# EAGLE board OpenDeck-r2.1.0 (EAGLE 7.4.0)
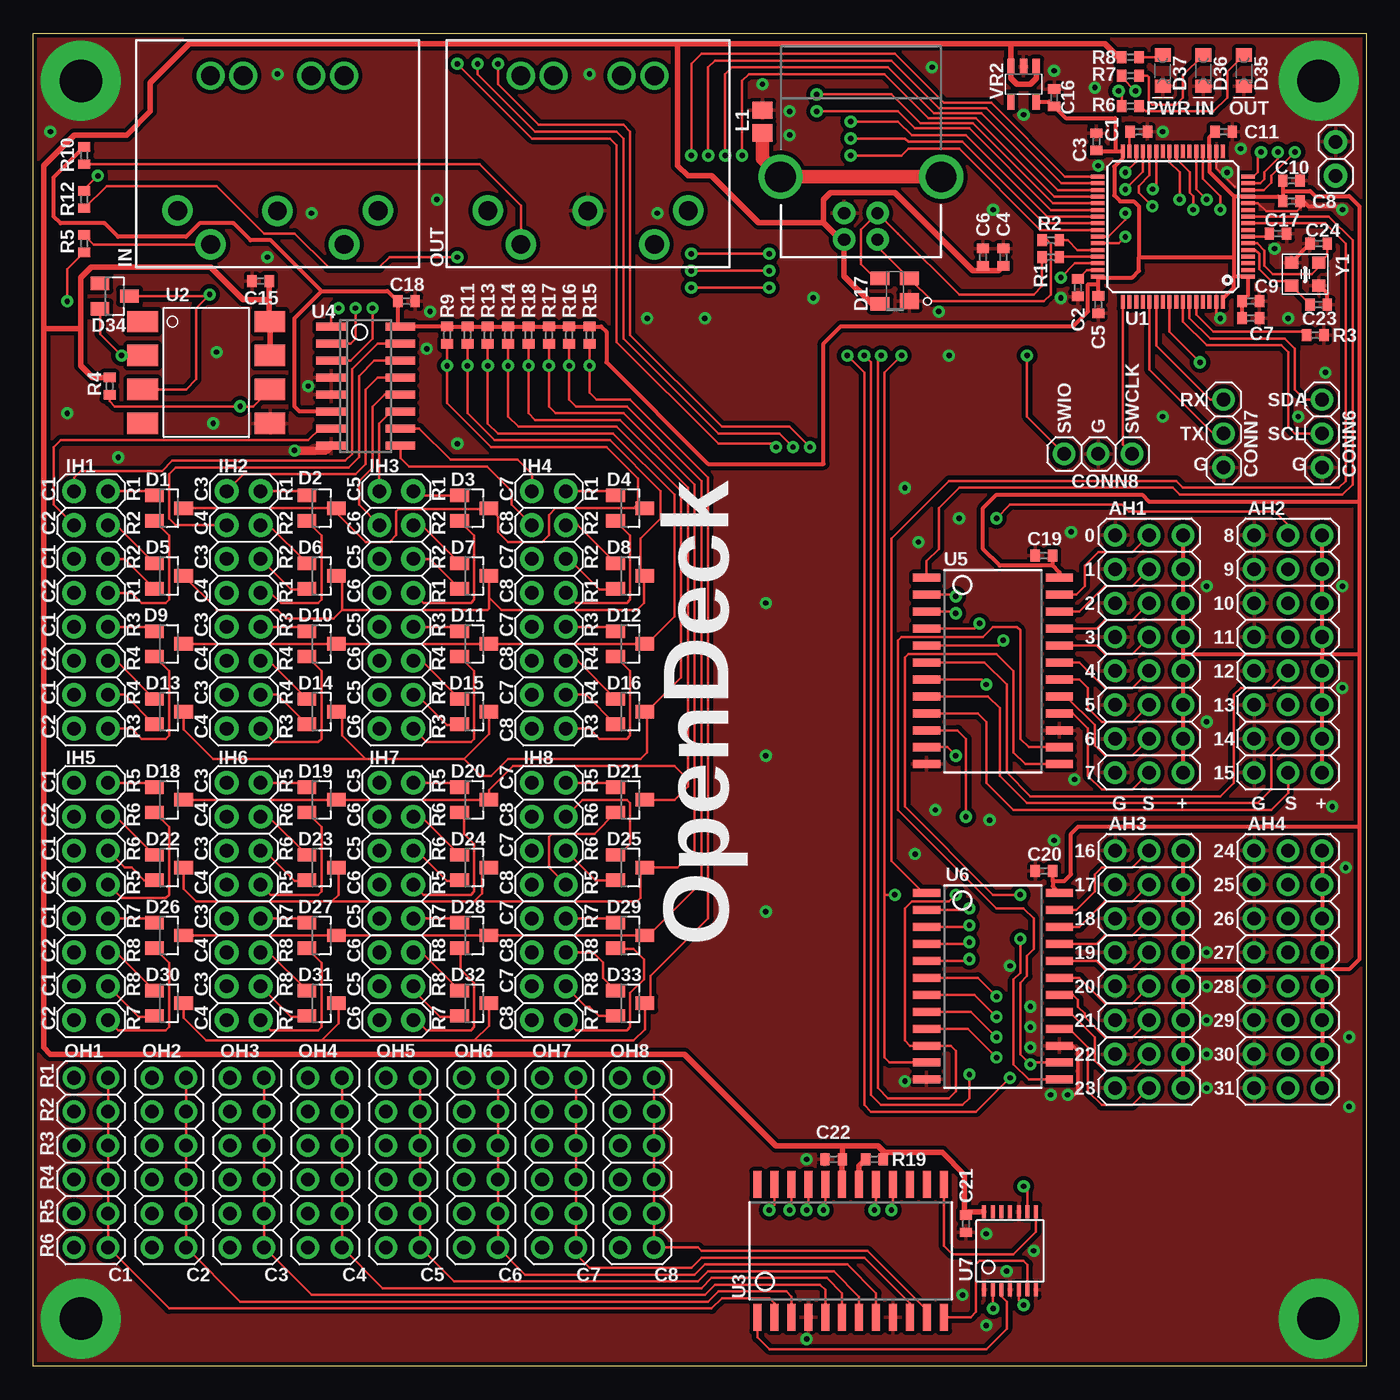
[diagram p5: board, top side]
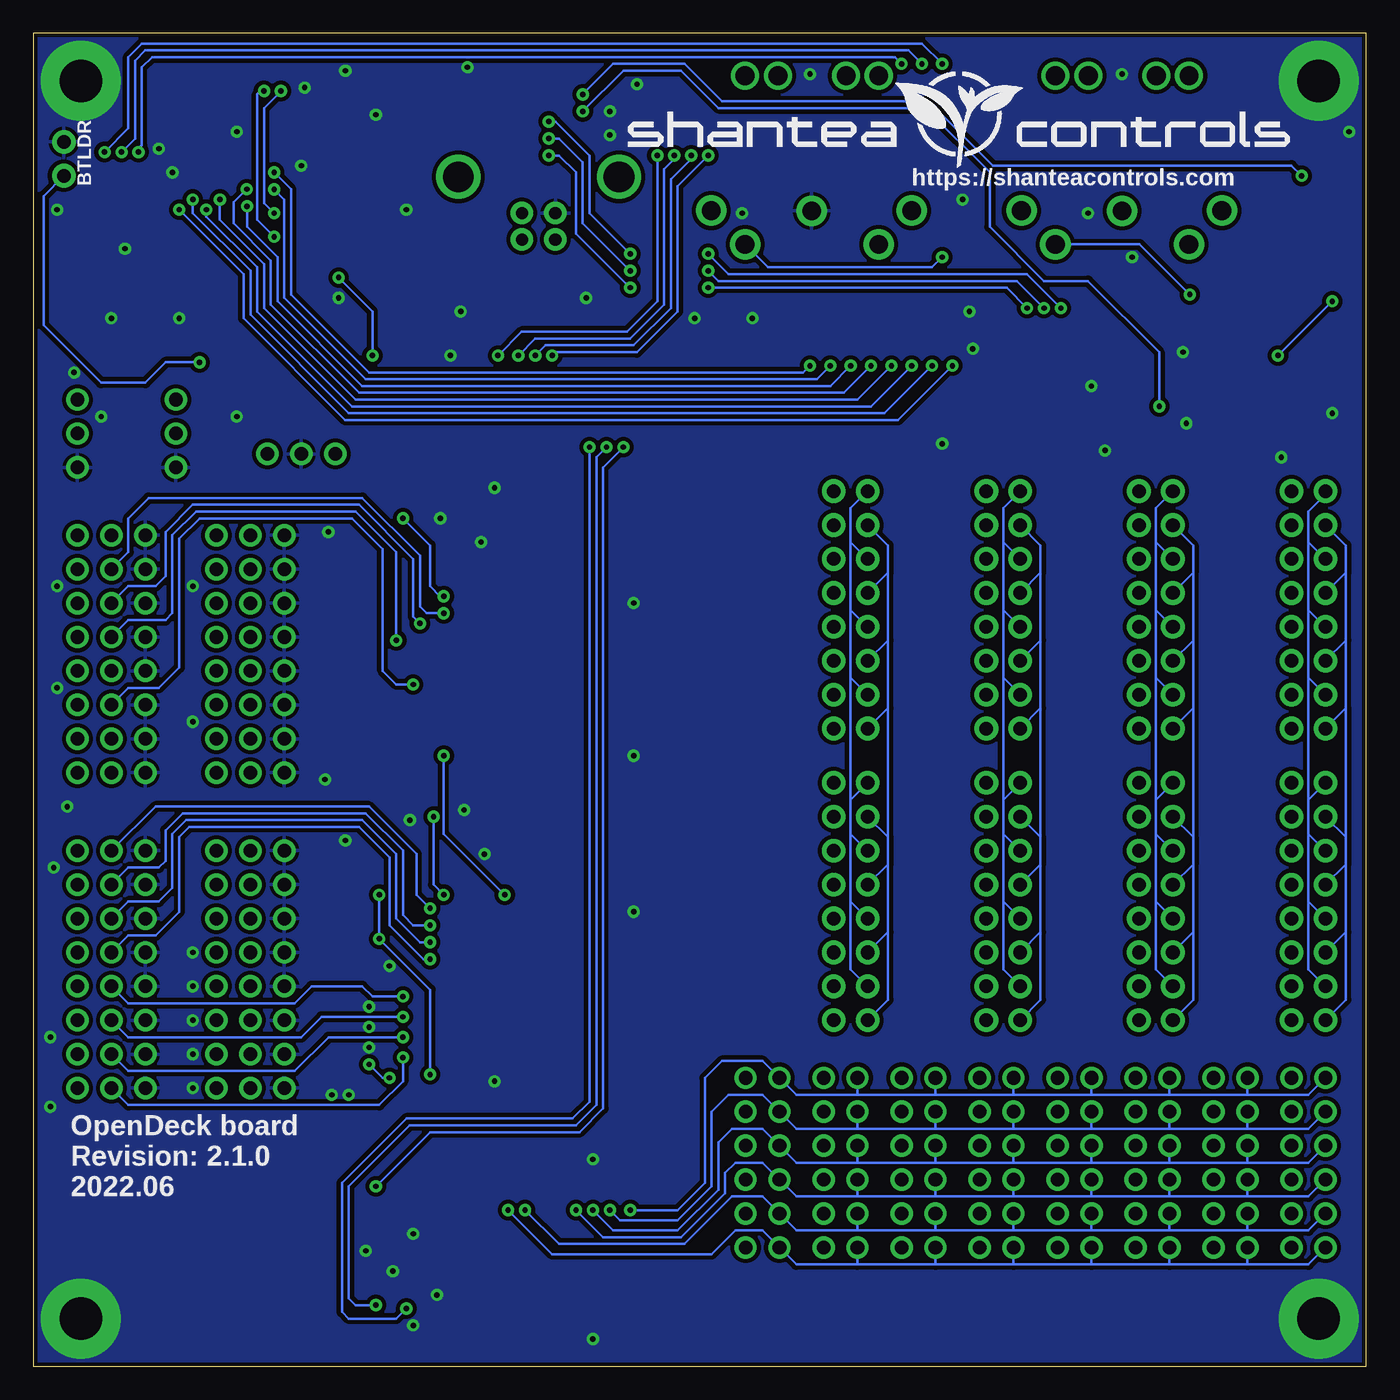
[diagram p6: board, bottom side, seen from below]

Size 99.82 x 99.82 mm. Coordinates in mm from the lower left corner, seen from the top.
Outline: 0,99.82 99.82,99.82 99.82,0 0,0 0,99.82
Copper layers (1*16): Top 0.035mm / dielectric 1.5mm / Bottom 0.035mm
Design rules "smiery *": minimum track width 8mil, minimum drill 12mil, track to track 7mil, track to pad 5mil, pad to pad 5mil, via to via 6mil, smd to smd 0mil, copper to edge 12mil, drill to drill 10mil, minimum pad ring 13mil, minimum via ring 10mil, stop-mask expansion 2mil, vias tented up to drill 25mil, thermal gap 10mil
Net classes: 0 default: width 0.203 mm; 1 vcc: width 0.254 mm

## Footprints (pad centres in the part's own frame; a part is rotated, then mirrored left to right if it is on the bottom)
3X08-2.54 = drill 1.016: 1 -8.89,-2.54; 2 -8.89,0; 3 -8.89,2.54; 4 -6.35,-2.54; 5 -6.35,0; 6 -6.35,2.54; 7 -3.81,-2.54; 8 -3.81,0; 9 -3.81,2.54; 10 -1.27,-2.54; 11 -1.27,0; 12 -1.27,2.54; 13 1.27,-2.54; 14 1.27,0; 15 1.27,2.54; 16 3.81,-2.54; 17 3.81,0; 18 3.81,2.54; 19 6.35,-2.54; 20 6.35,0; 21 6.35,2.54; 22 8.89,-2.54; 23 8.89,0; 24 8.89,2.54
C0402 = smd 0.7 x 0.9: 1 -0.65,0; 2 0.65,0
USB-B-PTH = drill 0.914 pad 1.676: D+ 1.25,-4.572; D- 1.25,-6.553; GND -1.25,-4.572; VBUS -1.25,-6.553 | drill 2.286: S1 -6.02,-1.854; S2 6.02,-1.854
1X02-2.54-V = drill 1.016 pad 1.778: 1 -1.27,0; 2 1.27,0
DIN5 = drill 1.4 pad 2.286: 1 -7.483,-4.768; 2 -0.003,-4.778; 3 7.527,-4.768; 4 -5.013,-7.298; 5 4.987,-7.288 | drill 1.4 pad 2: 6 4.987,5.341; 7 -5.02,5.341; 8 -2.582,5.341; 9 2.523,5.341
1X03-2.54-V = drill 1.016: 1 -2.54,0; 2 0,0; 3 2.54,0
SOT23 = smd 1.4 x 1: 1 -1.1,0.95; 2 -1.1,-0.95; 3 1.1,0
SOT143 = smd 1.44 x 1.2: 1 -1.1,0.75 | smd 1.44 x 1: 2 -1.1,-0.95; 3 1.1,-0.95; 4 1.1,0.95
0805_LED = smd 0.978 x 1.2: A -1.175,0; C 1.18,0
2X08-2.54 = drill 1.016 pad 1.778: 1 -8.89,-1.27; 2 -8.89,1.27; 3 -6.35,-1.27; 4 -6.35,1.27; 5 -3.81,-1.27; 6 -3.81,1.27; 7 -1.27,-1.27; 8 -1.27,1.27; 9 1.27,-1.27; 10 1.27,1.27; 11 3.81,-1.27; 12 3.81,1.27; 13 6.35,-1.27; 14 6.35,1.27; 15 8.89,-1.27; 16 8.89,1.27
L0805 = smd 1.3 x 1.5: 1 -0.85,0; 2 0.85,0
2X06-2.54-V = drill 1.016: 1 -6.35,-1.27; 2 -6.35,1.27; 3 -3.81,-1.27; 4 -3.81,1.27; 5 -1.27,-1.27; 6 -1.27,1.27; 7 1.27,-1.27; 8 1.27,1.27; 9 3.81,-1.27; 10 3.81,1.27; 11 6.35,-1.27; 12 6.35,1.27
R0402 = smd 0.7 x 0.9: 1 -0.65,0; 2 0.65,0
TQFP-64-10X10 = smd 1 x 0.3: 1 -5.625,3.75; 2 -5.625,3.25; 3 -5.625,2.75; 4 -5.625,2.25; 5 -5.625,1.75; 6 -5.625,1.25; 7 -5.625,0.75; 8 -5.625,0.25; 9 -5.625,-0.25; 10 -5.625,-0.75; 11 -5.625,-1.25; 12 -5.625,-1.75; 13 -5.625,-2.25; 14 -5.625,-2.75; 15 -5.625,-3.25; 16 -5.625,-3.75; 33 5.625,-3.75; 34 5.625,-3.25; 35 5.625,-2.75; 36 5.625,-2.25; 37 5.625,-1.75; 38 5.625,-1.25; 39 5.625,-0.75; 40 5.625,-0.25; 41 5.625,0.25; 42 5.625,0.75; 43 5.625,1.25; 44 5.625,1.75; 45 5.625,2.25; 46 5.625,2.75; 47 5.625,3.25; 48 5.625,3.75 | smd 0.3 x 1: 17 -3.75,-5.625; 18 -3.25,-5.625; 19 -2.75,-5.625; 20 -2.25,-5.625; 21 -1.75,-5.625; 22 -1.25,-5.625; 23 -0.75,-5.625; 24 -0.25,-5.625; 25 0.25,-5.625; 26 0.75,-5.625; 27 1.25,-5.625; 28 1.75,-5.625; 29 2.25,-5.625; 30 2.75,-5.625; 31 3.25,-5.625; 32 3.75,-5.625; 49 3.75,5.625; 50 3.25,5.625; 51 2.75,5.625; 52 2.25,5.625; 53 1.75,5.625; 54 1.25,5.625; 55 0.75,5.625; 56 0.25,5.625; 57 -0.25,5.625; 58 -0.75,5.625; 59 -1.25,5.625; 60 -1.75,5.625; 61 -2.25,5.625; 62 -2.75,5.625; 63 -3.25,5.625; 64 -3.75,5.625
SMD-8 = smd 2.3 x 1.6: 1 -4.77,3.81; 2 -4.77,1.27; 3 -4.77,-1.27; 4 -4.77,-3.81; 5 4.77,-3.81; 6 4.77,-1.27; 7 4.77,1.27; 8 4.77,3.81
SO24-W = smd 2.032 x 0.6: 1 -4.975,6.985; 2 -4.975,5.715; 3 -4.975,4.445; 4 -4.975,3.175; 5 -4.975,1.905; 6 -4.975,0.635; 7 -4.975,-0.635; 8 -4.975,-1.905; 9 -4.975,-3.175; 10 -4.975,-4.445; 11 -4.975,-5.715; 12 -4.975,-6.985; 13 4.975,-6.985; 14 4.975,-5.715; 15 4.975,-4.445; 16 4.975,-3.175; 17 4.975,-1.905; 18 4.975,-0.635; 19 4.975,0.635; 20 4.975,1.905; 21 4.975,3.175; 22 4.975,4.445; 23 4.975,5.715; 24 4.975,6.985
SO16 = smd 2.2 x 0.6: 1 -2.6,4.445; 2 -2.6,3.175; 3 -2.6,1.905; 4 -2.6,0.635; 5 -2.6,-0.635; 6 -2.6,-1.905; 7 -2.6,-3.175; 8 -2.6,-4.445; 9 2.6,-4.445; 10 2.6,-3.175; 11 2.6,-1.905; 12 2.6,-0.635; 13 2.6,0.635; 14 2.6,1.905; 15 2.6,3.175; 16 2.6,4.445
TSSOP14 = smd 0.991 x 0.305: 1 -2.918,1.95; 2 -2.918,1.3; 3 -2.918,0.65; 4 -2.918,0; 5 -2.918,-0.65; 6 -2.918,-1.3; 7 -2.918,-1.95; 8 2.918,-1.95; 9 2.918,-1.3; 10 2.918,-0.65; 11 2.918,0; 12 2.918,0.65; 13 2.918,1.3; 14 2.918,1.95
SOT23-5 = smd 1.2 x 0.55: 1 1.3,-0.95; 2 1.3,0; 3 1.3,0.95; 4 -1.3,0.95; 5 -1.3,-0.95
CRYSTAL-SMD-2.5X2 = smd 1 x 0.9: 1 -1.025,-0.875; 2 1.025,-0.875; 3 1.025,0.875; 4 -1.025,0.875

## Placement (x,y rotation side)
AH1  PINHD-3X08  [3X08-2.54]  83.57,53.34 270 top
AH2  PINHD-3X08  [3X08-2.54]  93.98,53.34 270 top
AH3  PINHD-3X08  [3X08-2.54]  83.57,29.72 270 top
AH4  PINHD-3X08  [3X08-2.54]  93.98,29.72 270 top
C1  2.2u  [C0402]  82.8,92.46 180 top
C2  2.2u  [C0402]  78.23,80.77 270 top
C3  100n  [C0402]  79.63,91.69 90 top
C4  100n  [C0402]  72.64,83.06 270 top
C5  100n  [C0402]  79.76,79.5 270 top
C6  10u  [C0402]  71.12,83.06 270 top
C7  100n  [C0402]  91.19,78.49 0 top
C8  100n  [C0402]  94.23,87.25 0 top
C9  100n  [C0402]  91.19,79.76 0 top
C10  100n  [C0402]  94.23,88.77 0 top
C11  100n  [C0402]  89.15,92.46 0 top
C15  100n  [C0402]  17.02,81.28 0 top
C16  1u  [C0402]  76.45,95 90 top
C17  100n  [C0402]  93.22,84.84 0 top
C18  100n  [C0402]  27.94,79.76 180 top
C19  100n  [C0402]  75.69,60.71 0 top
C20  100n  [C0402]  75.69,37.08 0 top
C21  100n  [C0402]  69.85,10.67 270 top
C22  100n  [C0402]  59.94,15.49 180 top
C23  10p  [C0402]  96.27,79.5 0 top
C24  10p  [C0402]  96.27,84.07 180 top
CONN1  USB-B-H  [USB-B-PTH]  61.98,90.93 0 top
CONN2  PINHD-1X02-TH-2.54MM  [1X02-2.54-V]  97.54,90.42 90 top
CONN3  MIDI_CONN-STD  [DIN5]  18.29,91.31 0 top
CONN4  MIDI_CONN-STD  [DIN5]  41.53,91.31 0 top
CONN6  PINHD-1X03-TH-2.54MM  [1X03-2.54-V]  96.52,69.85 270 top
CONN7  PINHD-1X03-TH-2.54MM  [1X03-2.54-V]  89.15,69.85 270 top
CONN8  PINHD-1X03-TH-2.54MM  [1X03-2.54-V]  79.76,68.33 0 top
D1  BAW56  [SOT23]  10.16,64.26 0 top
D2  BAW56  [SOT23]  21.59,64.26 0 top
D3  BAW56  [SOT23]  33.02,64.26 0 top
D4  BAW56  [SOT23]  44.7,64.26 0 top
D5  BAW56  [SOT23]  10.16,59.18 0 top
D6  BAW56  [SOT23]  21.59,59.18 0 top
D7  BAW56  [SOT23]  33.02,59.18 0 top
D8  BAW56  [SOT23]  44.7,59.18 0 top
D9  BAW56  [SOT23]  10.16,54.1 0 top
D10  BAW56  [SOT23]  21.59,54.1 0 top
D11  BAW56  [SOT23]  33.02,54.1 0 top
D12  BAW56  [SOT23]  44.7,54.1 0 top
D13  BAW56  [SOT23]  10.16,49.02 0 top
D14  BAW56  [SOT23]  21.59,49.02 0 top
D15  BAW56  [SOT23]  33.02,49.02 0 top
D16  BAW56  [SOT23]  44.7,49.02 0 top
D17  PRTR5V0U2X  [SOT143]  64.52,80.52 180 top
D18  BAW56  [SOT23]  10.16,42.42 0 top
D19  BAW56  [SOT23]  21.59,42.42 0 top
D20  BAW56  [SOT23]  33.02,42.42 0 top
D21  BAW56  [SOT23]  44.7,42.42 0 top
D22  BAW56  [SOT23]  10.16,37.34 0 top
D23  BAW56  [SOT23]  21.59,37.34 0 top
D24  BAW56  [SOT23]  33.02,37.34 0 top
D25  BAW56  [SOT23]  44.7,37.34 0 top
D26  BAW56  [SOT23]  10.16,32.26 0 top
D27  BAW56  [SOT23]  21.59,32.26 0 top
D28  BAW56  [SOT23]  33.02,32.26 0 top
D29  BAW56  [SOT23]  44.7,32.26 0 top
D30  BAW56  [SOT23]  10.16,27.18 0 top
D31  BAW56  [SOT23]  21.59,27.18 0 top
D32  BAW56  [SOT23]  33.02,27.18 0 top
D33  BAW56  [SOT23]  44.7,27.18 0 top
D34  BAW56  [SOT23]  6.1,80.14 0 top
D35  Red  [0805_LED]  90.68,97.03 270 top
D36  Yellow  [0805_LED]  87.63,97.03 270 top
D37  Green  [0805_LED]  84.58,97.03 270 top
IH1  PINHD-2X08-TH-2.54MM  [2X08-2.54]  4.32,56.64 270 top
IH2  PINHD-2X08-TH-2.54MM  [2X08-2.54]  15.75,56.64 270 top
IH3  PINHD-2X08-TH-2.54MM  [2X08-2.54]  27.18,56.64 270 top
IH4  PINHD-2X08-TH-2.54MM  [2X08-2.54]  38.61,56.64 270 top
IH5  PINHD-2X08-TH-2.54MM  [2X08-2.54]  4.32,34.8 270 top
IH6  PINHD-2X08-TH-2.54MM  [2X08-2.54]  15.75,34.8 270 top
IH7  PINHD-2X08-TH-2.54MM  [2X08-2.54]  27.18,34.8 270 top
IH8  PINHD-2X08-TH-2.54MM  [2X08-2.54]  38.61,34.8 270 top
L1  FERRITE_BEAD-BLM21PG221SN1D  [L0805]  54.61,93.22 270 top
OH1  PINHD-2X06-TH-2.54MM  [2X06-2.54-V]  4.32,15.24 270 top
OH2  PINHD-2X06-TH-2.54MM  [2X06-2.54-V]  10.16,15.24 270 top
OH3  PINHD-2X06-TH-2.54MM  [2X06-2.54-V]  16,15.24 270 top
OH4  PINHD-2X06-TH-2.54MM  [2X06-2.54-V]  21.84,15.24 270 top
OH5  PINHD-2X06-TH-2.54MM  [2X06-2.54-V]  27.69,15.24 270 top
OH6  PINHD-2X06-TH-2.54MM  [2X06-2.54-V]  33.53,15.24 270 top
OH7  PINHD-2X06-TH-2.54MM  [2X06-2.54-V]  39.37,15.24 270 top
OH8  PINHD-2X06-TH-2.54MM  [2X06-2.54-V]  45.21,15.24 270 top
R1  22  [R0402]  76.2,83.06 0 top
R2  22  [R0402]  76.2,84.33 180 top
R3  10k  [R0402]  96.01,77.22 180 top
R4  4.7k  [R0402]  5.71,73.41 270 top
R5  220  [R0402]  3.81,84.07 270 top
R6  1k  [R0402]  82.17,94.36 180 top
R7  680  [R0402]  82.17,96.65 180 top
R8  1k  [R0402]  82.17,98.04 0 top
R9  4.7k  [R0402]  30.99,77.22 270 top
R10  33  [R0402]  3.81,90.68 90 top
R11  4.7k  [R0402]  32.51,77.22 270 top
R12  10  [R0402]  3.81,87.38 90 top
R13  4.7k  [R0402]  34.04,77.22 270 top
R14  4.7k  [R0402]  35.56,77.22 270 top
R15  4.7k  [R0402]  41.66,77.22 270 top
R16  4.7k  [R0402]  40.13,77.22 270 top
R17  4.7k  [R0402]  38.61,77.22 270 top
R18  4.7k  [R0402]  37.08,77.22 270 top
R19  10k  [R0402]  62.99,15.49 0 top
U1  STM32F405RGT6-10X10  [TQFP-64-10X10]  85.34,85.34 180 top
U2  6N137-SMD  [SMD-8]  12.95,74.42 0 top
U3  MAX7219  [SO24-W]  61.21,8.64 90 top
U4  74HC138-SO  [SO16]  24.89,73.41 0 top
U5  MC14067BDWR2G-SO24W  [SO24-W]  71.88,52.07 0 top
U6  MC14067BDWR2G-SO24W  [SO24-W]  71.88,28.45 0 top
U7  74125-TSSOP  [TSSOP14]  73.15,8.64 90 top
VR2  SPX3819M5  [SOT23-5]  74.17,96.01 90 top
Y1  12MHz  [CRYSTAL-SMD-2.5X2]  95.25,81.79 0 top

## Tracks (layer width: path | path; a pad name or v marks a point on that pad's centre or on a via)
+3V3
  Top 0.305: 81.03,90.97 U1.32 81.59,90.48 80.96,89.85 80.96,87.69 81.41,87.25 82.42,87.25 82.8,86.87 82.8,83.06 | 81.03,90.97 79.7,90.97 C3.1 | 79.72,81.03 U1.48 79.78,81.53 82.3,81.53 82.8,82.04 82.8,83.06 | 79.72,81.03 79.72,80.19 C5.1 | C11.1 88.09,92.05 U1.19 88.09,89.45 89.92,87.63 | C10.1 93.58,88.01 | 93.58,88.01 C8.1 93.24,87.59 U1.13 89.95,87.59 89.92,87.63 | 89.92,87.63 89.92,83.06 | 89.92,83.06 89.92,81.53 | 89.92,81.53 89.98,81.59 U1.1 90.97,80.19 C9.1 C7.1 | 81.03,90.97 81.03,93.47 77.33,93.47 C16.1 76.09,94.71 VR2.5 | 21.59,80.52 26.53,80.52 C18.2 27.29,78.05 U4.16 27.51,77.87 R9.1 R11.1 R13.1 R14.1 R18.1 R17.1 R16.1 R15.1 42.53,77.87 42.93,77.47 42.93,75.18 50.55,67.56 59.18,67.56 59.18,76.6 60.45,77.87 77.87,77.87 78.99,78.99 78.99,81.03 79.72,81.03 | 76.36,59.94 76.36,60.69 C19.2 | 76.36,36.32 76.36,37.07 C20.2 | 76.36,59.94 72.39,59.94 71.12,61.21 71.12,64.26 72.14,65.28 83.06,65.28 83.57,64.77 99.31,64.77 | 76.36,36.32 77.22,36.32 77.72,36.83 77.72,39.88 78.23,40.39 99.31,40.39 | 82.8,83.06 89.92,83.06 | U1.64 89.09,79.95 89.92,80.77 89.92,81.53 | 93.58,88.01 95.63,88.01 96.01,87.63 98.55,87.63 99.31,86.87 99.31,64.77 | AH1.3 AH1.6 AH1.9 AH1.12 86.11,53.34 | 86.11,53.34 AH1.15 AH1.18 AH1.21 AH1.24 | AH2.24 AH2.21 AH2.18 AH2.15 96.52,53.34 | AH2.3 AH2.6 AH2.9 AH2.12 96.52,53.34 | 99.31,64.77 99.31,53.34 | AH3.3 AH3.6 AH3.9 AH3.12 86.11,29.72 | AH3.24 AH3.21 AH3.18 AH3.15 86.11,29.72 | AH4.3 AH4.6 AH4.9 AH4.12 96.52,29.72 | 96.52,29.72 AH4.15 AH4.18 AH4.21 AH4.24 | 86.11,53.34 96.52,53.34 | 96.52,53.34 99.31,53.34 | 99.31,53.34 99.31,40.39 | 99.31,40.39 99.31,30.48 98.55,29.72 96.52,29.72
  Top 0.305: 86.11,29.72 96.52,29.72 | R10.2 1.52,89.04 1.52,86.11 2.03,85.6 5.33,85.6 6.35,84.58 11.43,84.58 12.45,85.6 14.99,85.6 16.26,84.33 17.78,84.33 21.59,80.52 | U5.24 76.86,59.44 76.36,59.94 | 76.36,36.32 76.36,35.93 U6.24 | U4.6 19.94,71.5 19.56,71.88 19.56,78.49 21.59,80.52
+5V
  Top 0.406: R8.1 81.28,98.04 80.26,99.06 73.15,99.06 | 73.15,99.06 48.26,99.06 | 3.56,77.72 3.56,74.93 4.43,74.06 R4.1 | 3.56,77.72 3.56,81.53 4.32,82.3 13.3,82.3 15.72,79.87 17.56,79.87 17.67,79.76 | U2.7 U2.8 17.67,78.29 17.67,79.76 | 3.56,77.72 0.76,77.72 | D17.4 62.81,79.57 60.73,81.66 CONN1.VBUS 60.45,84.38 59.18,85.65 | 59.18,85.65 59.18,87.38 59.69,87.88 64.52,87.88 70.36,82.04 71.12,82.04 | 48.26,99.06 48.26,89.92 49.02,89.15 50.8,89.15 54.3,85.65 59.18,85.65 | 48.26,99.06 11.68,99.06 8.76,96.14 8.76,93.98 6.99,92.2 3.05,92.2 0.76,89.92 0.76,77.72 | 0.76,77.72 0.76,23.88 1.27,23.37 48.77,23.37 55.63,16.51 60.71,16.51 | C15.2 17.67,79.76 | U7.14 70.09,11.55 C21.1 69.74,11.43 69.74,14.34 68.07,16 63.75,16 63.64,16.11 | R19.2 63.64,16.11 | 63.64,16.11 63.25,16.51 60.71,16.51 | U3.19 60.58,15.48 C22.1 60.59,16.4 60.71,16.51 | VR2.1 75.12,96.45 74.68,96.01 73.66,96.01 73.22,96.45 VR2.3 73.22,98.99 73.15,99.06 | 71.12,82.04 72.28,82.04 C4.2 | C6.2 71.12,82.04
A_IN_0
  Top 0.203: U5.23 78.11,57.78 78.74,58.42 78.74,59.94 79.76,60.96 82.3,60.96 AH1.2
A_IN_1
  Top 0.203: U5.22 78.36,56.52 80.26,58.42 82.3,58.42 AH1.5
A_IN_2
  Top 0.203: U5.21 79.63,55.24 80.26,55.88 82.3,55.88 AH1.8
A_IN_3
  Top 0.203: U5.20 79.63,53.98 80.26,53.34 82.3,53.34 AH1.11
A_IN_4
  Top 0.203: U5.19 78.36,52.7 80.26,50.8 82.3,50.8 AH1.14
A_IN_5
  Top 0.203: U5.18 78.36,51.44 78.99,50.8 78.99,49.28 80.01,48.26 82.3,48.26 AH1.17
A_IN_6
  Top 0.203: U5.17 77.34,50.16 79.5,48.01 79.5,46.48 80.26,45.72 82.3,45.72 AH1.20
A_IN_7
  Top 0.203: U5.16 77.85,48.9 78.99,47.75 78.99,44.2 80.01,43.18 82.3,43.18 AH1.23
A_IN_8  (via drill 0.4 pad 0.6)
  Top 0.203: v72.14,63.5 73.15,64.52 81.53,64.52 82.04,64.01 92.96,64.01 93.98,62.99 AH2.2 | U5.2 68.96,57.78 v69.09,57.66
  Bottom 0.203: v72.14,63.5 70.1,61.47 70.1,58.42 69.34,57.66 v69.09,57.66
A_IN_9  (via drill 0.4 pad 0.6)
  Top 0.203: U5.3 68.96,56.52 v69.09,56.39
  Bottom 0.203: v69.09,56.39 70.36,56.39 70.87,56.9 70.87,60.71 75.18,65.02 91.19,65.02 92.71,63.5 92.71,60.96 AH2.5
A_IN_10  (via drill 0.4)
  Top 0.203: U5.4 70.48,55.24 v70.87,55.63
  Bottom 0.203: v70.87,55.63 71.37,56.13 71.37,60.45 75.44,64.52 87.88,64.52 89.92,62.48 89.92,59.18 90.68,58.42 92.71,58.42 AH2.8
A_IN_11  (via drill 0.4)
  Top 0.203: v72.64,54.36 72.26,53.98 U5.5
  Bottom 0.203: v72.64,54.36 72.64,60.96 75.69,64.01 87.63,64.01 89.41,62.23 89.41,56.39 89.92,55.88 92.71,55.88 AH2.11
A_IN_12
  Top 0.203: U5.6 71.25,52.7 72.9,51.05 72.9,44.45 74.68,42.67 88.9,42.67 89.92,43.69 89.92,50.29 90.42,50.8 92.71,50.8 AH2.14
A_IN_13  (via drill 0.4)
  Top 0.203: U5.7 70.99,51.44 v71.37,51.05
  Bottom 0.203: v71.37,51.05 72.64,51.05 73.66,52.07 73.66,61.21 75.95,63.5 87.38,63.5 88.9,61.98 88.9,52.32 90.42,50.8 92.71,50.8 AH2.17
A_IN_14
  Top 0.203: U5.8 71.5,50.16 72.39,49.28 72.39,44.2 74.42,42.16 91.69,42.16 92.71,43.18 92.71,45.72 AH2.20
A_IN_15
  Top 0.203: U5.9 70.74,48.9 71.37,48.26 71.37,43.69 73.41,41.66 92.71,41.66 93.98,42.93 AH2.23
A_IN_16
  Top 0.203: U6.23 78.11,34.16 79.5,35.56 79.5,36.83 80.01,37.34 82.3,37.34 AH3.2
A_IN_17
  Top 0.203: U6.22 78.36,32.89 80.26,34.8 82.3,34.8 AH3.5
A_IN_18
  Top 0.203: U6.21 79.63,31.62 80.26,32.26 82.3,32.26 AH3.8
A_IN_19
  Top 0.203: U6.20 79.63,30.35 80.26,29.72 82.3,29.72 AH3.11
A_IN_20
  Top 0.203: U6.19 78.36,29.08 80.26,27.18 82.3,27.18 AH3.14
A_IN_21
  Top 0.203: U6.18 77.85,27.81 78.23,27.43 78.23,26.92 78.74,26.42 78.74,26.16 80.26,24.64 82.3,24.64 AH3.17
A_IN_22
  Top 0.203: U6.17 77.6,26.54 79.5,24.64 79.5,22.86 80.26,22.1 82.3,22.1 AH3.20
A_IN_23
  Top 0.203: 77.09,25.27 U6.16 77.6,25.27 78.99,23.88 78.99,20.57 80.01,19.56 82.3,19.56 AH3.23
A_IN_24  (via drill 0.4)
  Top 0.203: U6.2 69.98,34.16 v70.1,34.29
  Bottom 0.203: v70.1,34.29 71.12,35.31 71.12,38.35 74.68,41.91 90.68,41.91 AH4.2
A_IN_25  (via drill 0.4)
  Top 0.203: U6.3 69.98,32.89 v70.1,33.02
  Bottom 0.203: v70.1,33.02 71.37,33.02 72.14,33.78 72.14,38.61 74.93,41.4 88.65,41.4 89.92,40.13 89.92,37.85 90.42,37.34 92.71,37.34 AH4.5
A_IN_26  (via drill 0.4)
  Top 0.203: U6.4 69.98,31.62 v70.1,31.75
  Bottom 0.203: v70.1,31.75 70.87,31.75 72.64,33.53 72.64,38.35 75.18,40.89 88.39,40.89 89.41,39.88 89.41,35.81 90.42,34.8 92.71,34.8 AH4.8
A_IN_27  (via drill 0.4)
  Top 0.203: U6.5 69.98,30.35 v70.1,30.48
  Bottom 0.203: v70.1,30.48 70.61,30.48 73.15,33.02 73.15,38.1 75.44,40.39 88.14,40.39 88.9,39.62 88.9,34.04 90.68,32.26 92.71,32.26 AH4.11
A_IN_28  (via drill 0.4)
  Top 0.203: U6.6 70.74,29.08 v72.14,27.69
  Bottom 0.203: v72.14,27.69 74.42,27.69 75.18,28.45 78.99,28.45 80.26,27.18 92.71,27.18 AH4.14
A_IN_29  (via drill 0.4)
  Top 0.203: U6.7 70.48,27.81 v72.14,26.16
  Bottom 0.203: v72.14,26.16 78.23,26.16 79.76,24.64 92.71,24.64 AH4.17
A_IN_30  (via drill 0.4)
  Top 0.203: U6.8 70.23,26.54 v72.14,24.64
  Bottom 0.203: v72.14,24.64 77.72,24.64 80.26,22.1 92.71,22.1 AH4.20
A_IN_31  (via drill 0.4)
  Top 0.203: U6.9 69.98,25.27 v72.14,23.11
  Bottom 0.203: v72.14,23.11 72.14,21.34 73.91,19.56 92.71,19.56 AH4.23
BC_1
  Top 0.203: IH1.1 3.05,66.55 3.56,67.06 9.65,67.06 10.41,67.82 23.37,67.82 23.88,68.33 23.88,74.68 25.78,76.58 U4.15
  Bottom 0.203: IH5.1 4.32,42.42 | 4.32,42.42 4.32,39.88 | 4.32,39.88 IH5.5 | IH5.9 4.32,34.8 | 4.32,34.8 4.32,39.88 | IH5.13 4.32,29.72 4.32,34.8 | IH1.1 3.05,65.28 4.32,64.01 4.32,61.72 | 4.32,61.72 IH1.5 | IH1.9 4.32,56.64 | 4.32,56.64 4.32,61.72 | 4.32,51.56 4.32,56.64 | IH1.13 4.32,51.56 | 4.32,51.56 4.32,42.42
BC_2
  Top 0.203: IH1.3 1.52,64.52 1.52,68.83 2.03,69.34 20.57,69.34 21.46,70.23 U4.7
  Bottom 0.203: IH1.3 1.52,61.47 1.52,59.44 | 1.52,59.44 IH1.7 | IH1.11 1.52,54.36 | 1.52,54.36 1.52,59.44 | 1.52,49.28 1.52,54.36 | IH5.3 1.52,39.62 | 1.52,39.62 1.52,37.59 | 1.52,37.59 IH5.7 | IH5.11 1.52,32.51 | 1.52,32.51 1.52,37.59 | IH5.15 1.52,27.43 1.52,32.51 | IH1.15 1.52,49.28 | 1.52,49.28 1.52,39.62
BC_3
  Top 0.203: IH2.1 15.75,66.8 24.13,66.8 24.89,67.56 24.89,73.15 25.78,74.04 U4.13
  Bottom 0.203: IH6.1 15.75,42.42 | 15.75,42.42 15.75,39.88 | 15.75,39.88 IH6.5 | IH6.9 15.75,34.8 | 15.75,34.8 15.75,39.88 | IH6.13 15.75,29.72 15.75,34.8 | IH2.1 15.75,64.26 15.75,61.72 | 15.75,61.72 IH2.5 | IH2.9 15.75,56.64 | 15.75,56.64 15.75,61.72 | 15.75,51.56 15.75,56.64 | IH2.13 15.75,51.56 | 15.75,51.56 15.75,42.42
BC_4
  Top 0.203: IH2.3 10.67,62.99 10.16,63.5 10.16,66.8 10.67,67.31 23.62,67.31 24.38,68.07 24.38,74.17 25.53,75.31 U4.14
  Bottom 0.203: IH2.3 12.95,61.47 12.95,59.44 | 12.95,59.44 IH2.7 | IH2.11 12.95,54.36 | 12.95,54.36 12.95,59.44 | IH2.15 12.95,49.28 | 12.95,49.28 12.95,54.36 | 12.95,39.62 12.95,37.59 | 12.95,37.59 IH6.7 | IH6.11 12.95,32.51 | 12.95,32.51 12.95,37.59 | IH6.15 12.95,27.43 12.95,32.51 | IH6.3 12.95,39.62 | 12.95,39.62 12.95,49.28
BC_5
  Top 0.203: IH3.1 25.91,70.61 26.8,71.5 U4.11
  Bottom 0.203: IH3.1 27.18,64.26 27.18,61.72 | 27.18,61.72 IH3.5 | IH3.9 27.18,56.64 | 27.18,56.64 27.18,61.72 | IH3.13 27.18,51.56 | 27.18,51.56 27.18,56.64 | 27.18,42.42 27.18,39.88 | 27.18,39.88 IH7.5 | IH7.9 27.18,34.8 | 27.18,34.8 27.18,39.88 | IH7.13 27.18,29.72 27.18,34.8 | IH7.1 27.18,42.42 | 27.18,42.42 27.18,51.56
BC_6
  Top 0.203: IH3.3 24.38,64.52 24.38,66.29 25.4,67.31 25.4,71.88 26.29,72.77 U4.12
  Bottom 0.203: 24.38,39.62 24.38,37.59 | 24.38,37.59 IH7.7 | IH7.11 24.38,32.51 | 24.38,32.51 24.38,37.59 | IH7.15 24.38,27.43 24.38,32.51 | IH3.3 24.38,61.47 24.38,59.44 | 24.38,59.44 IH3.7 | IH3.11 24.38,54.36 | 24.38,54.36 24.38,59.44 | IH3.15 24.38,49.28 | 24.38,49.28 24.38,54.36 | IH7.3 24.38,39.62 | 24.38,39.62 24.38,49.28
BC_7
  Top 0.203: IH4.1 37.34,66.8 36.26,67.88 31.24,67.88 28.89,70.23 U4.10
  Bottom 0.203: 38.61,42.42 38.61,39.88 | 38.61,39.88 IH8.5 | IH8.9 38.61,34.8 | 38.61,34.8 38.61,39.88 | IH8.13 38.61,29.72 38.61,34.8 | IH4.1 38.61,64.26 38.61,61.72 | 38.61,61.72 IH4.5 | IH4.9 38.61,56.64 | 38.61,56.64 38.61,61.72 | IH4.13 38.61,51.56 | 38.61,51.56 38.61,56.64 | IH8.1 38.61,42.42 | 38.61,42.42 38.61,51.56
BC_8
  Top 0.203: IH4.3 35.81,64.52 35.81,65.53 33.97,67.37 28.13,67.37 27.49,68.01 U4.9
  Bottom 0.203: 35.81,39.62 35.81,37.59 | 35.81,37.59 IH8.7 | IH8.11 35.81,32.51 | 35.81,32.51 35.81,37.59 | IH8.15 35.81,27.43 35.81,32.51 | IH4.3 35.81,61.47 35.81,59.44 | 35.81,59.44 IH4.7 | IH4.11 35.81,54.36 | 35.81,54.36 35.81,59.44 | IH4.15 35.81,49.28 | 35.81,49.28 35.81,54.36 | IH8.3 35.81,39.62 | 35.81,39.62 35.81,49.28
BOOT0
  Top 0.203: U1.60 87.09,78.77 88.39,77.47 95.11,77.47 R3.2
BR_1  (via drill 0.4)
  Top 0.203: 44.96,64.26 39.12,64.26 38.61,63.75 38.61,62.23 38.1,61.72 35.56,61.72 34.8,62.48 34.8,63.58 D3.3 34.04,64.18 27.35,64.18 27.18,64.01 27.18,62.23 26.67,61.72 24.89,61.72 22.69,63.92 D2.3 D1.3 | 44.96,64.26 D4.3 | 44.96,64.26 45.3,64.6 45.3,66.46 42.93,68.83 34.29,68.83 30.99,72.14 v30.99,74.93 R9.2 | U1.20 87.59,88.94 88.9,87.63 v88.9,86.61
  Bottom 0.203: v30.99,74.93 35.05,70.87 76.45,70.87 84.07,78.49 84.07,81.79 v88.9,86.61
BR_2  (via drill 0.4)
  Top 0.203: D6.3 22.78,59.18 23.11,58.84 23.11,56.64 | 23.11,56.64 22.48,56.01 18.92,56.01 18.29,56.64 13.72,56.64 13.72,56.73 D5.3 | 23.11,56.64 34.04,56.64 34.12,56.73 D7.3 34.12,57.57 35.05,56.64 45.21,56.64 45.72,57.15 45.72,59.18 D8.3 45.47,59.52 45.47,61.98 46.99,63.5 46.99,65.53 43.18,69.34 34.54,69.34 32.51,71.37 v32.51,74.93 R11.2 | U1.21 87.09,88.17 v87.88,87.38
  Bottom 0.203: v32.51,74.93 36.07,71.37 76.2,71.37 83.57,78.74 83.57,82.04 87.88,86.36 v87.88,87.38
BR_3  (via drill 0.4)
  Top 0.203: D9.3 D10.3 D11.3 D12.3 45.97,54.1 48.01,56.13 48.01,65.28 43.43,69.85 34.8,69.85 34.04,70.61 v34.04,74.93 R13.2 | v86.87,86.61 86.87,87.63 86.61,87.88 86.61,89.41 85.59,90.43 U1.24
  Bottom 0.203: v34.04,74.93 37.08,71.88 75.95,71.88 83.06,78.99 83.06,82.3 86.87,86.11 v86.87,86.61
BR_4  (via drill 0.4)
  Top 0.203: 45.97,49.02 48.51,51.56 48.51,65.53 43.69,70.36 36.32,70.36 35.56,71.12 v35.56,74.93 R14.2 | D15.3 34.12,47.33 32.26,45.47 | 32.26,45.47 24.89,45.47 | 24.89,45.47 23.11,47.24 23.11,48.6 D14.3 | D13.3 11.26,47.67 13.46,45.47 24.89,45.47 | 45.97,49.02 45.97,45.97 45.47,45.47 35.56,45.47 34.29,44.2 33.53,44.2 32.26,45.47 | D16.3 45.97,49.02 | v85.85,87.38 85.85,89.41 85.09,90.17 U1.25
  Bottom 0.203: v35.56,74.93 38.1,72.39 75.69,72.39 82.55,79.25 82.55,82.55 85.85,85.85 v85.85,87.38
BR_5  (via drill 0.4)
  Top 0.203: D30.3 11.26,26.08 12.95,24.38 21.59,24.38 | 21.59,24.38 22.86,25.65 22.86,27.01 D31.3 | D32.3 34.12,25.48 33.02,24.38 | 33.02,24.38 21.59,24.38 | 33.02,24.38 44.96,24.38 45.8,25.23 D33.3 46.23,27.6 46.23,29.21 50.55,33.53 50.55,66.55 44.7,72.39 42.16,72.39 41.66,72.9 v41.66,74.93 R15.2 | v81.79,89.41 82.59,90.21 U1.30
  Bottom 0.203: v41.66,74.93 42.16,74.42 74.68,74.42 80.52,80.26 80.52,88.14 v81.79,89.41
BR_6  (via drill 0.4)
  Top 0.203: D26.3 D27.3 D28.3 | D28.3 34.12,31.92 | D28.3 D29.3 46.06,32.26 50.04,36.24 50.04,66.29 44.45,71.88 40.64,71.88 40.13,72.39 v40.13,74.93 R16.2 | U1.29 83.09,89.44 v81.79,88.14
  Bottom 0.203: v40.13,74.93 41.15,73.91 74.93,73.91 81.03,80.01 81.03,87.38 v81.79,88.14
BR_7  (via drill 0.4)
  Top 0.203: 22.35,34.8 33.02,34.8 | 33.02,34.8 33.61,35.39 33.61,36.83 D24.3 | D22.3 11.26,35.73 12.19,34.8 22.35,34.8 | 22.35,34.8 22.86,35.31 22.86,37.17 D23.3 | 33.02,34.8 45.21,34.8 45.47,35.05 45.47,37 D25.3 48.26,37.34 49.53,38.61 49.53,66.04 44.2,71.37 39.12,71.37 38.61,71.88 v38.61,74.93 R17.2 | U1.28 83.59,89.18 82.8,88.39 82.8,87.88 v83.82,86.87
  Bottom 0.203: v38.61,74.93 40.13,73.41 75.18,73.41 81.53,79.76 81.53,83.06 83.82,85.34 v83.82,86.87
BR_8  (via drill 0.4)
  Top 0.203: D18.3 D19.3 D20.3 34.12,43.14 35.94,44.96 48.01,44.96 49.02,43.94 | D21.3 48.01,42.42 49.02,43.43 49.02,43.94 | 49.02,43.94 49.02,65.79 43.94,70.87 37.59,70.87 37.08,71.37 v37.08,74.93 R18.2 | U1.27 84.09,88.41 v83.84,88.16
  Bottom 0.203: v37.08,74.93 39.12,72.9 75.44,72.9 82.04,79.5 82.04,82.8 84.84,85.6 84.84,87.16 v83.84,88.16
BTLDR_BUTTON  (via drill 0.4 pad 0.6)
  Top 0.203: U1.56 85.09,77.47 v87.38,75.18
  Bottom 0.203: v87.38,75.18 89.92,75.18 91.44,73.66 94.74,73.66 99.06,77.98 99.06,87.63 CONN2.1
D+
  Top 0.203: U1.45 76.89,83.09 R1.2
D+X
  Top 0.203: D17.3 63.06,81.47 61.98,82.55 61.98,85.11 CONN1.D+ 64.75,84.84 64.77,84.84 69.34,80.26 74.93,80.26 75.55,80.88 R1.1
D-
  Top 0.203: U1.44 78.2,83.59 77.47,84.33 R2.1
D-X
  Top 0.203: R2.2 75.95,84.33 76.2,84.07 76.2,80.26 75.69,79.76 67.33,79.76 D17.2 63.23,83.86 CONN1.D-
DEC_DI_A0  (via drill 0.4)
  Top 0.203: U1.39 75.96,86.09 69.85,92.2 65.79,92.2 64.77,93.22 v61.21,93.22 | v49.28,83.31 v55.12,83.31 | U4.1 22.29,78.68 v22.86,79.25
  Bottom 0.203: v22.86,79.25 25.4,81.79 47.75,81.79 v49.28,83.31 | v61.21,93.22 60.71,93.22 58.17,90.68 58.17,86.36 v55.12,83.31
DEC_DI_A1  (via drill 0.4)
  Top 0.203: U4.2 23.75,76.58 24.13,76.96 v24.13,79.25 | U1.40 75.7,85.59 69.6,91.69 65.53,91.69 65.28,91.95 v61.21,91.95 | v49.28,82.04 v55.12,82.04
  Bottom 0.203: v24.13,79.25 26.16,81.28 48.51,81.28 v49.28,82.04 | v61.21,91.95 60.45,91.95 58.67,90.17 58.67,85.6 v55.12,82.04
DEC_DI_A2  (via drill 0.4)
  Top 0.203: v25.4,79.25 25.4,76.96 23.75,75.31 U4.3 | U1.41 75.43,85.09 69.34,91.19 65.53,91.19 65.02,90.68 v61.21,90.68 | v49.28,80.77 v55.12,80.77
  Bottom 0.203: v25.4,79.25 26.92,80.77 v49.28,80.77 | v61.21,90.68 60.45,90.68 59.18,89.41 59.18,84.84 v55.12,80.77
GND  (via drill 0.4 pad 0.6, 3.2 pad 6)
  Top 0.203: U1.63 88.59,78.79 v88.9,78.49 | U1.12 91.72,87.09 92.33,86.49 94.61,86.49 94.88,86.76 C8.2 | U1.18 88.59,89.71 88.9,89.41 | 88.9,89.41 89.98,88.33 | v89.41,89.41 88.9,89.41 | U5.15 77.17,47.62
  Top 0.254: U6.15 77.85,24 78.23,23.62 78.23,20.57 77.98,20.32 v77.47,20.32 | C24.2 95.62,83.95
  Top 0.305: C23.2 96.92,80.37 96.38,80.91 Y1.2 | C8.2 95.12,87.25 95.5,86.87 97.79,86.87 v98.04,86.61 | C24.2 95.62,84.05 Y1.4
  Top 0.61: v19.56,68.58 21.91,68.58 U4.8
  other vias: 13.46,70.61 20.83,86.36 41.66,96.77 54.86,57.15 58.42,80.01 30.23,87.38 73.15,29.97 98.55,19.43 2.54,71.37 77.72,62.48 1.27,92.46 18.29,96.77 13.72,75.95 6.35,68.07 3.56,96.27 96.27,96.27 96.27,3.56 3.56,3.56 90.42,91.19 67.31,97.28 71.88,86.61 76.96,80.01 76.45,39.37 77.98,43.94 67.56,41.66 92.96,83.69 84.58,92.46 54.86,45.72 54.86,34.04 50.29,78.49 45.97,78.49 84.58,71.12 96.77,74.42 94.74,71.12 93.98,78.49 68.58,75.69 67.82,78.99 65.28,65.79 69.34,63.5 66.29,61.72 79.76,89.92 65.28,21.34 54.61,96.01 56.64,93.98 56.64,92.2 71.37,3.05 29.46,76.2 31.75,69.09 29.72,78.99 98.3,37.34 74.68,26.92 74.68,25.4 74.68,23.88 87.88,30.99 87.88,25.91 98.55,24.64 87.88,20.83 71.63,40.89 66.04,38.35 87.88,23.37 87.88,28.45 76.2,20.32 97.28,41.91 87.88,48.26 87.88,58.42 98.04,58.42 98.04,50.8 17.53,83.06 79.5,95.76 20.57,73.41 57.91,2.03 71.37,9.91 57.91,15.49 69.6,5.33 74.93,8.64 72.9,7.11 74.17,93.73 76.45,97.03 46.74,86.36
  pour Bottom (isolate 0.305): 0,99.82 99.82,99.82 99.82,0 0,0
  pour Top (isolate 0.305): 0,99.82 99.82,99.82 99.82,0 0,0
IH1_2
  Top 0.203: IH1.2 8.74,65.53 D1.1
IH1_4
  Top 0.203: IH1.4 6.2,62.99 D5.1
IH1_6
  Top 0.203: IH1.6 6.84,60.45 D5.2
IH1_8
  Top 0.203: IH1.8 7.37,57.91 8.13,57.15 9.91,57.15 10.16,57.4 10.16,62.21 D1.2
IH1_10
  Top 0.203: IH1.10 8.74,55.37 D9.1
IH1_12
  Top 0.203: IH1.12 6.2,52.83 D13.1
IH1_14
  Top 0.203: IH1.14 6.84,50.29 D13.2
IH1_16
  Top 0.203: IH1.16 7.37,47.75 8.13,46.99 9.91,46.99 10.16,47.24 10.16,52.05 D9.2
IH2_2
  Top 0.203: IH2.2 20.17,65.53 D2.1
IH2_4
  Top 0.203: 20.32,60.3 D6.1 17.63,62.99 IH2.4
IH2_6
  Top 0.203: 20.32,58.06 D6.2 20.42,58.17 19.3,58.17 IH2.6
IH2_8
  Top 0.203: IH2.8 17.78,57.91 18.54,57.15 21.34,57.15 21.59,57.4 21.59,62.21 D2.2
IH2_10
  Top 0.203: IH2.10 20.17,55.37 D10.1
IH2_12
  Top 0.203: IH2.12 17.63,52.83 D14.1
IH2_14
  Top 0.203: 20.32,47.9 D14.2 18.27,50.29 IH2.14
IH2_16
  Top 0.203: IH2.16 18.03,46.74 21.34,46.74 21.59,46.99 21.59,52.05 D10.2
IH3_2
  Top 0.203: D3.1 28.77,65.21 IH3.2
IH3_4
  Top 0.203: IH3.4 29.06,62.99 D7.1
IH3_6
  Top 0.203: IH3.6 29.7,60.45 D7.2
IH3_8
  Top 0.203: IH3.8 29.21,57.15 32.77,57.15 33.02,57.4 33.02,62.21 D3.2
IH3_10
  Top 0.203: IH3.10 31.6,55.37 D11.1
IH3_12
  Top 0.203: IH3.12 29.06,52.83 D15.1
IH3_14
  Top 0.203: IH3.14 28.7,50.29 30.99,48.01 31.85,48.01 D15.2
IH3_16
  Top 0.203: IH3.16 29.46,46.74 32.77,46.74 33.02,46.99 33.02,52.05 D11.2
IH4_2
  Top 0.203: IH4.2 43.28,65.53 D4.1
IH4_4
  Top 0.203: IH4.4 40.74,62.99 D8.1
IH4_6
  Top 0.203: IH4.6 40.13,60.45 42.42,58.17 43.54,58.17 D8.2
IH4_8
  Top 0.203: IH4.8 40.64,57.15 44.45,57.15 44.7,57.4 44.7,62.21 D4.2
IH4_10
  Top 0.203: IH4.10 43.28,55.37 D12.1
IH4_12
  Top 0.203: IH4.12 40.74,52.83 D16.1
IH4_14
  Top 0.203: IH4.14 41.38,50.29 D16.2
IH4_16
  Top 0.203: IH4.16 41.66,47.75 42.42,46.99 44.45,46.99 44.7,47.24 44.7,52.05 D12.2
IH5_2
  Top 0.203: IH5.2 8.74,43.69 D18.1
IH5_4
  Top 0.203: IH5.4 6.2,41.15 D22.1
IH5_6
  Top 0.203: D22.2 8.32,36.39 7.37,37.34 6.86,37.34 IH5.6
IH5_8
  Top 0.203: IH5.8 6.6,35.05 9.91,35.05 10.16,35.31 10.16,40.37 D18.2
IH5_10
  Top 0.203: IH5.10 8.74,33.53 D26.1
IH5_12
  Top 0.203: IH5.12 6.2,30.99 D30.1
IH5_14
  Top 0.203: IH5.14 7.87,26.16 8.99,26.16 D30.2
IH5_16
  Top 0.203: IH5.16 6.35,25.15 9.91,25.15 10.16,25.4 10.16,30.21 D26.2
IH6_2
  Top 0.203: IH6.2 20.17,43.69 D19.1
IH6_4
  Top 0.203: IH6.4 17.63,41.15 D23.1
IH6_6
  Top 0.203: IH6.6 17.27,38.61 19.56,36.32 20.42,36.32 D23.2
IH6_8
  Top 0.203: IH6.8 17.78,35.31 21.34,35.31 21.59,35.56 21.59,40.37 D19.2
IH6_10
  Top 0.203: IH6.10 20.17,33.53 D27.1
IH6_12
  Top 0.203: IH6.12 17.63,30.99 D31.1
IH6_14
  Top 0.203: IH6.14 19.3,26.16 20.42,26.16 D31.2
IH6_16
  Top 0.203: IH6.16 17.78,25.15 21.34,25.15 21.59,25.4 21.59,30.21 D27.2
IH7_2
  Top 0.203: IH7.2 31.6,43.69 D20.1
IH7_4
  Top 0.203: IH7.4 29.06,41.15 D24.1
IH7_6
  Top 0.203: IH7.6 28.7,38.61 30.99,36.32 31.85,36.32 D24.2
IH7_8
  Top 0.203: IH7.8 29.21,35.31 32.77,35.31 33.02,35.56 33.02,39.12 32.26,39.88 32.26,41.3 32.09,41.47 D20.2
IH7_10
  Top 0.203: IH7.10 31.6,33.53 D28.1
IH7_12
  Top 0.203: IH7.12 29.06,30.99 D32.1
IH7_14
  Top 0.203: IH7.14 28.45,28.19 30.48,26.16 31.85,26.16 D32.2
IH7_16
  Top 0.203: IH7.16 28.7,25.91 29.46,25.15 32.77,25.15 33.02,25.4 33.02,28.7 32,29.72 32,31.22 D28.2
IH8_2
  Top 0.203: IH8.2 43.28,43.69 D21.1
IH8_4
  Top 0.203: D25.1 43.88,38.29 44.7,39.12 44.7,42.16 44.45,42.42 41.15,42.42 IH8.4
IH8_6
  Top 0.203: D25.2 42.1,36.39 IH8.6
IH8_8
  Top 0.203: IH8.8 38.61,37.34 38.61,39.62 38.86,39.88 42.01,39.88 D21.2
IH8_10
  Top 0.203: IH8.10 43.28,33.53 D29.1
IH8_12
  Top 0.203: IH8.12 41.91,30.99 42.67,30.23 42.67,29.06 D33.1
IH8_14
  Top 0.203: D33.2 42.35,26.23 41.66,26.92 41.4,26.92 IH8.14
IH8_16
  Top 0.203: IH8.16 40.64,25.15 44.45,25.15 44.7,25.4 44.7,27.94 45.72,28.96 45.72,30.48 44.96,31.24 43.67,31.24 D29.2
LC_1
  Top 0.203: OH1.2 OH1.4 OH1.6 OH1.8 OH1.10 OH1.12 10.16,4.32 50.8,4.32 51.56,5.08 55.12,5.08 55.5,4.7 U3.2
LC_2
  Top 0.203: OH2.2 OH2.4 OH2.6 OH2.8 OH2.10 OH2.12 15.49,4.83 50.55,4.83 51.31,5.59 56.39,5.59 56.77,5.21 U3.3
LC_3
  Top 0.203: OH3.2 OH3.4 OH3.6 OH3.8 OH3.10 OH3.12 20.83,5.33 50.29,5.33 51.05,6.1 58.93,6.1 59.31,5.71 U3.5
LC_4
  Top 0.203: OH4.2 OH4.4 OH4.6 OH4.8 OH4.10 OH4.12 26.16,5.84 50.04,5.84 50.8,6.6 59.44,6.6 60.58,5.46 U3.6
LC_5
  Top 0.203: OH5.2 OH5.4 OH5.6 OH5.8 OH5.10 OH5.12 31.5,6.35 49.78,6.35 50.55,7.11 59.94,7.11 61.85,5.21 U3.7
LC_6
  Top 0.203: OH6.10 OH6.12 36.83,6.86 49.53,6.86 50.29,7.62 60.96,7.62 63.12,5.46 U3.8 | OH6.10 OH6.8 OH6.6 OH6.4 OH6.2 | OH6.10 34.8,10.92
LC_7
  Top 0.203: OH7.2 OH7.4 OH7.6 OH7.8 OH7.10 OH7.12 40.64,8.38 41.66,7.37 49.28,7.37 50.04,8.13 62.23,8.13 65.66,4.7 U3.10
LC_8
  Top 0.203: OH8.2 OH8.4 OH8.6 OH8.8 OH8.10 OH8.12 49.78,8.89 50.04,8.64 62.48,8.64 66.93,4.19 U3.11
LR_1_MO  (via drill 0.4 pad 0.6)
  Top 0.203: U3.23 55.5,12.06 v55.12,11.68
  Bottom 0.203: 8.89,20.32 14.73,20.32 | 14.73,20.32 20.57,20.32 | 20.57,20.32 26.42,20.32 | 26.42,20.32 32.26,20.32 | 32.26,20.32 38.1,20.32 | 38.1,20.32 42.67,20.32 OH8.1 45.21,22.86 48.26,22.86 49.53,21.59 49.53,13.72 51.56,11.68 v55.12,11.68 | OH7.1 38.1,20.32 | OH6.1 32.26,20.32 | OH5.1 26.42,20.32 | OH4.1 20.57,20.32 | OH3.1 14.73,20.32 | OH2.1 8.89,20.32 | OH1.1 4.32,20.32 8.89,20.32
LR_2_MO  (via drill 0.4 pad 0.6)
  Top 0.203: U3.22 56.77,11.81 v56.64,11.68
  Bottom 0.203: 8.89,17.78 14.73,17.78 | 14.73,17.78 20.57,17.78 | 20.57,17.78 26.42,17.78 | 26.42,17.78 32.26,17.78 | 32.26,17.78 38.1,17.78 | 38.1,17.78 42.67,17.78 OH8.3 45.21,20.32 47.75,20.32 49.02,19.05 49.02,13.46 51.56,10.92 55.88,10.92 v56.64,11.68 | OH7.3 38.1,17.78 | OH2.3 8.89,17.78 | OH3.3 14.73,17.78 | OH4.3 20.57,17.78 | OH5.3 26.42,17.78 | OH6.3 32.26,17.78 | OH1.3 4.32,17.78 8.89,17.78
LR_3_MO  (via drill 0.4 pad 0.6)
  Top 0.203: U3.17 63.12,11.81 v62.99,11.68
  Bottom 0.203: OH1.9 4.32,10.16 8.89,10.16 | 8.89,10.16 14.73,10.16 | 14.73,10.16 20.57,10.16 | 20.57,10.16 26.42,10.16 | 26.42,10.16 32.26,10.16 | 32.26,10.16 38.1,10.16 | 38.1,10.16 42.67,10.16 OH8.9 45.21,12.7 47.5,12.7 51.05,9.14 60.45,9.14 v62.99,11.68 | OH7.9 38.1,10.16 | OH6.9 32.26,10.16 | OH5.9 26.42,10.16 | OH4.9 20.57,10.16 | OH3.9 14.73,10.16 | OH2.9 8.89,10.16
LR_4_MO  (via drill 0.4 pad 0.6)
  Top 0.203: U3.16 64.39,11.81 v64.26,11.68
  Bottom 0.203: OH1.11 4.32,7.62 8.89,7.62 | 8.89,7.62 14.73,7.62 | 14.73,7.62 20.57,7.62 | 20.57,7.62 26.42,7.62 | 26.42,7.62 32.26,7.62 | 32.26,7.62 38.1,7.62 | 38.1,7.62 42.67,7.62 OH8.11 45.21,10.16 47.24,10.16 49.02,8.38 60.96,8.38 v64.26,11.68 | OH7.11 38.1,7.62 | OH6.11 32.26,7.62 | OH5.11 26.42,7.62 | OH4.11 20.57,7.62 | OH3.11 14.73,7.62 | OH2.11 8.89,7.62
LR_5_MO  (via drill 0.4 pad 0.6)
  Top 0.203: U3.21 58.04,11.81 v57.91,11.68
  Bottom 0.203: OH1.5 4.32,15.24 8.89,15.24 | 8.89,15.24 14.73,15.24 | 14.73,15.24 20.57,15.24 | 20.57,15.24 26.42,15.24 | 26.42,15.24 32.26,15.24 | 32.26,15.24 38.1,15.24 | 38.1,15.24 42.67,15.24 OH8.5 45.21,17.78 47.5,17.78 48.51,16.76 48.51,13.21 51.56,10.16 56.39,10.16 v57.91,11.68 | OH2.5 8.89,15.24 | OH3.5 14.73,15.24 | OH4.5 20.57,15.24 | OH5.5 26.42,15.24 | OH6.5 32.26,15.24 | OH7.5 38.1,15.24
LR_6_MO  (via drill 0.4 pad 0.6)
  Top 0.203: U3.20 59.31,11.81 v59.18,11.68
  Bottom 0.203: OH1.7 4.32,12.7 8.89,12.7 | 8.89,12.7 14.73,12.7 | 14.73,12.7 20.57,12.7 | 20.57,12.7 26.42,12.7 | 26.42,12.7 32.26,12.7 | 32.26,12.7 38.1,12.7 | 38.1,12.7 42.67,12.7 OH8.7 45.21,15.24 47.24,15.24 48.01,14.48 48.01,12.95 51.31,9.65 57.15,9.65 v59.18,11.68 | OH7.7 38.1,12.7 | OH6.7 32.26,12.7 | OH5.7 26.42,12.7 | OH4.7 20.57,12.7 | OH3.7 14.73,12.7 | OH2.7 8.89,12.7
MAX7219_CLK  (via drill 0.4, 0.4 pad 0.6)
  Top 0.203: U1.14 92.16,88.09 92.71,88.65 92.71,89.15 v94.49,90.93 | v55.63,68.83 55.37,69.09 51.31,69.09 43.69,76.71 43.69,91.44 43.18,91.95 37.34,91.95 v31.75,97.54 | U7.9 74.45,13.18 v74.17,13.46
  Bottom 0.203: v31.75,97.54 33.27,99.06 91.69,99.06 92.71,98.04 92.71,92.71 v94.49,90.93 | v55.63,68.83 57.15,67.31 57.15,19.3 58.93,17.53 70.1,17.53 v74.17,13.46
MAX7219_DIN  (via drill 0.4, 0.4 pad 0.6)
  Top 0.203: U1.16 91.38,89.09 91.69,89.41 91.69,90.68 v91.95,90.93 | v34.8,97.54 34.8,96.01 37.85,92.96 44.2,92.96 44.7,92.46 44.7,77.22 51.56,70.36 56.64,70.36 v58.17,68.83 | U7.2 71.85,4.35 v71.88,4.32
  Bottom 0.203: v91.95,90.93 91.95,91.19 91.69,91.44 91.69,97.28 90.93,98.04 35.31,98.04 v34.8,97.54 | v58.17,68.83 58.17,19.81 59.44,18.54 71.88,18.54 76.71,13.72 76.71,4.06 76.2,3.56 72.64,3.56 v71.88,4.32
MAX7219_LOAD  (via drill 0.4, 0.4 pad 0.6)
  Top 0.203: U1.15 91.9,88.59 92.2,88.9 92.2,89.41 93.22,90.42 v93.22,90.93 | v56.9,68.83 55.88,69.85 51.31,69.85 44.2,76.96 44.2,91.95 43.69,92.46 37.59,92.46 33.27,96.77 v33.27,97.54 | U7.5 73.8,4.94 v74.17,4.57
  Bottom 0.203: v33.27,97.54 34.29,98.55 91.44,98.55 92.2,97.79 92.2,91.95 v93.22,90.93 | v56.9,68.83 57.66,68.07 57.66,19.56 59.18,18.03 71.63,18.03 76.2,13.46 76.2,5.08 75.69,4.57 v74.17,4.57
MIDI_IN  (via drill 0.4, 0.4 pad 0.6)
  Top 0.203: R4.2 5.71,72.26 6.1,71.88 v15.49,71.88 16.45,71.88 U2.6 | v58.67,93.98 64.77,93.98 66.04,92.71 70.1,92.71 76.22,86.59 U1.38
  Bottom 0.203: v58.67,93.98 55.63,97.03 51.31,97.03 48.51,94.23 33.02,94.23 28.19,89.41 28.19,85.34 24.13,81.28 20.83,81.28 15.49,75.95 v15.49,71.88
MIDI_IN_4
  Top 0.203: CONN3.4 4.52,84.02 R5.1
MIDI_IN_5  (via drill 0.4 pad 0.6)
  Top 0.203: U2.3 11.43,73.15 12.19,73.91 12.19,79.25 v13.21,80.26 13.08,80.14 D34.3
  Bottom 0.203: CONN3.5 16.97,84.03 v13.21,80.26
MIDI_IN_DIODE_OUT  (via drill 0.4 pad 0.6)
  Top 0.203: U2.2 v6.6,75.69 5,77.3 D34.2 | v2.54,79.76 2.54,82.15 R5.2
  Bottom 0.203: v6.6,75.69 v2.54,79.76
MIDI_IN_LED  (via drill 0.4 pad 0.6)
  Top 0.203: U1.43 81.3,84.09 v81.79,84.58 | R7.2 81.52,96.53 v82.55,95.5
  Bottom 0.203: v81.79,84.58 83.06,85.85 83.06,95.25 82.8,95.5 v82.55,95.5
MIDI_IN_LED_R
  Top 0.203: R7.1 83.44,96.65 83.57,96.52 83.57,94.74 83.82,94.49 85.6,94.49 86.11,95 86.11,96.68 D36.A
MIDI_OUT  (via drill 0.4)
  Top 0.203: v58.67,95.25 64.26,95.25 66.42,93.09 70.36,93.09 76.36,87.09 U1.37 | R12.2 3.81,88.14 v4.83,89.15
  Bottom 0.203: v58.67,95.25 56.39,97.54 51.05,97.54 48.26,94.74 32.77,94.74 27.94,89.92 5.59,89.92 v4.83,89.15
MIDI_OUT_4
  Top 0.203: R10.1 33.42,90.03 36.52,86.93 CONN4.4
MIDI_OUT_5  (via drill 0.4)
  Top 0.203: v31.75,83.06 26.67,83.06 25.91,82.3 22.1,82.3 19.56,84.84 17.27,84.84 13.72,88.39 5.48,88.39 R12.1
  Bottom 0.203: CONN4.5 44.79,82.3 32.51,82.3 v31.75,83.06
MIDI_OUT_LED  (via drill 0.4 pad 0.6)
  Top 0.203: v81.79,86.36 81.79,85.85 80.53,84.59 U1.42 | R6.2 81.52,95.27 v81.28,95.5
  Bottom 0.203: v81.79,86.36 82.55,87.12 82.55,94.23 v81.28,95.5
MIDI_OUT_LED_R
  Top 0.203: R6.1 82.82,94.47 83.31,93.98 88.39,93.98 89.41,95 89.41,96.93 D35.A
MUX_COMMON_1
  Top 0.203: U1.10 90.98,86.11 97.03,86.11 98.81,84.33 98.81,66.04 98.04,65.28 85.85,65.28 85.34,65.79 69.34,65.79 67.82,64.26 67.82,61.21 66.91,60.3 U5.1
MUX_COMMON_2
  Top 0.203: U6.1 66.67,35.43 64.26,37.85 64.26,61.98 68.58,66.29 85.6,66.29 86.11,65.79 97.79,65.79 98.3,66.29 98.3,84.07 96.77,85.6 U1.9
MUX_S0  (via drill 0.4)
  Top 0.203: U5.10 69.22,47.62 69.85,46.99 v69.85,41.15 | v69.09,35.31 68.58,34.8 65.79,34.8 65.28,34.29 65.28,24.38 65.66,24 U6.10 68.71,24 69.09,23.62 69.09,20.57 68.58,20.07 64.01,20.07 63.25,20.83 63.25,75.44 v63.5,75.69 | v51.82,90.68 51.82,96.77 52.32,97.28 64.01,97.28 67.44,93.85 70.99,93.85 76.75,88.09 U1.35
  Bottom 0.203: v69.85,41.15 69.85,36.07 v69.09,35.31 | v51.82,90.68 51.82,90.42 52.58,89.66 52.58,79.5 55.12,76.96 62.23,76.96 v63.5,75.69
MUX_S1  (via drill 0.4)
  Top 0.203: U5.11 68.45,46.35 v69.09,45.72 | 63.75,35.31 63.75,23.11 64.14,22.73 U6.11 | 63.75,35.31 63.75,74.42 v65.02,75.69 | v64.52,35.31 63.75,35.31 | v53.09,90.68 53.09,96.27 53.59,96.77 63.75,96.77 67.06,93.47 70.61,93.47 76.49,87.59 U1.36
  Bottom 0.203: v69.09,45.72 69.09,39.88 v64.52,35.31 | v65.02,75.69 63.25,77.47 55.37,77.47 53.09,79.76 v53.09,90.68
MUX_S2  (via drill 0.4)
  Top 0.203: U5.14 74.55,46.35 73.91,46.99 73.91,55.12 73.66,55.37 71.88,55.37 71.12,54.61 65.02,54.61 64.77,54.36 64.77,41.66 72.14,34.29 74.17,34.29 74.93,33.53 74.93,31.24 74.42,30.73 74.42,29.21 73.91,28.7 73.91,23.37 v74.68,22.61 74.8,22.73 U6.14 | v73.15,21.59 70.61,19.05 62.74,19.05 62.23,19.56 62.23,74.42 v60.96,75.69 | v49.28,90.68 49.28,97.54 50.04,98.3 64.52,98.3 68.2,94.61 71.75,94.61 77.28,89.09 U1.33
  Bottom 0.203: v49.28,90.68 51.56,88.39 51.56,78.99 54.61,75.95 60.71,75.95 v60.96,75.69 | v73.15,21.59 73.66,21.59 v74.68,22.61
MUX_S3  (via drill 0.4)
  Top 0.203: U6.13 74.55,21.46 73.41,22.61 73.41,28.96 73.91,29.46 v73.91,32 | U5.13 74.3,45.09 73.41,45.97 73.41,52.07 72.14,53.34 65.53,53.34 65.28,53.09 65.28,41.91 71.88,35.31 v73.91,35.31 | v70.1,21.84 70.1,20.07 69.6,19.56 63.5,19.56 62.74,20.32 62.74,75.18 v62.23,75.69 | v50.55,90.68 50.55,97.28 51.05,97.79 64.26,97.79 67.82,94.23 71.37,94.23 77.01,88.59 U1.34
  Bottom 0.203: v73.91,35.31 v73.91,32 70.1,28.19 v70.1,21.84 | v50.55,90.68 50.55,90.42 52.07,88.9 52.07,79.25 54.86,76.45 61.47,76.45 v62.23,75.69
N$1
  Top 0.203: U1.31 82.09,92.4 C1.2
N$2
  Top 0.203: U1.47 78.9,82.09 C2.1
N$4
  Top 0.203: U3.1 54.23,2.16 55.12,1.27 71.37,1.27 72.9,2.79 72.9,4.83 72.5,5.22 U7.3
N$5
  Top 0.203: U3.12 70.21,3.66 70.61,4.06 70.61,7.62 70.87,7.87 74.17,7.87 74.45,7.59 U7.6
N$6
  Top 0.203: U7.8 75.1,10.08 73.41,8.38 68.83,8.38 68.2,9.02 U3.13
N$7
  Top 0.406: U3.18 61.85,15 R19.1
NRST
  Top 0.203: U1.7 92.33,84.59 C17.1
OSC_IN
  Top 0.203: U1.5 91.54,83.59 91.82,83.31 91.82,82.17 92.71,81.28 93.86,81.28 Y1.1 95.49,79.65 95.49,79.5 C23.1
OSC_OUT
  Top 0.203: U1.6 91.67,84.09 92.2,83.57 92.2,82.42 92.84,81.79 95.75,81.79 96.28,82.31 Y1.3 96.38,82.66 96.92,83.2 C24.1
PWR_LED_R
  Top 0.203: R8.2 84.42,98.04 D37.A
SCL
  Top 0.203: U1.58 86.09,78.24 87.88,76.45 93.47,76.45 93.98,75.95 93.98,70.36 94.49,69.85 CONN6.2
SDA
  Top 0.203: U1.59 86.59,78.51 88.14,76.96 93.73,76.96 94.49,76.2 94.49,73.15 95.25,72.39 CONN6.1
SWDCLK
  Top 0.203: U1.49 81.59,69.03 CONN8.3
SWDIO  (via drill 0.4)
  Top 0.203: U1.46 78.02,82.59 v76.96,81.53 | v74.42,75.69 74.42,71.12 CONN8.1
  Bottom 0.203: v74.42,75.69 74.42,78.99 v76.96,81.53
UART_RX
  Top 0.203: U1.54 84.09,76.43 88.14,72.39 CONN7.1
UART_TX
  Top 0.203: U1.53 83.59,74.65 88.39,69.85 CONN7.2
USB_SHIELD
  Top 1.016: L1.2 54.61,90.42 CONN1.S1 CONN1.S2

## Text on the board
tNames: PWR | IN | OUT | IN | OUT | RX | SDA | SWIO | G | SWCLK | TX | SCL | G | G | C1 | R1 | C3 | R1 | C5 | R1 | C7 | R1 | C2 | R2 | C4 | R2 | C6 | R2 | C8 | R2 | 0 | 8 | C1 | R2 | C3 | R2 | C5 | R2 | C7 | R2 | 1 | 9 | C2 | R1 | C4 | R1 | C6 | R1 | C8 | R1 | 2 | 10 | C1 | R3 | C3 | R3 | C5 | R3 | C7 | R3 | 3 | 11 | C2 | R4 | C4 | R4 | C6 | R4 | C8 | R4 | 4 | 12 | C1 | R4 | C3 | R4 | C5 | R4 | C7 | R4 | 5 | 13 | C2 | R3 | C4 | R3 | C6 | R3 | C8 | R3 | 6 | 14 | 7 | 15 | C1 | R5 | C3 | R5 | C5 | R5 | C7 | R5 | G | S | + | G | S | + | C2 | R6 | C4 | R6 | C6 | R6 | C8 | R6 | C1 | R6 | C3 | R6 | C5 | R6 | C7 | R6 | 16 | 24 | 17 | 25 | C2 | R5 | C4 | R5 | C6 | R5 | C8 | R5 | C1 | R7 | C3 | R7 | C5 | R7 | C7 | R7 | 18 | 26 | OpenDeck | C2 | R8 | C4 | R8 | C6 | R8 | C8 | R8 | 19 | 27 | C1 | R8 | C3 | R8 | C5 | R8 | C7 | R8 | 20 | 28 | C2 | R7 | C4 | R7 | C6 | R7 | C8 | R7 | 21 | 29 | 22 | 30 | R1 | 23 | 31 | R2 | R3 | R4 | R5 | R6 | C1 | C2 | C3 | C4 | C5 | C6 | C7 | C8
bNames: https://shanteacontrols.com | BTLDR | OpenDeck board / Revision: 2.1.0 / 2022.06